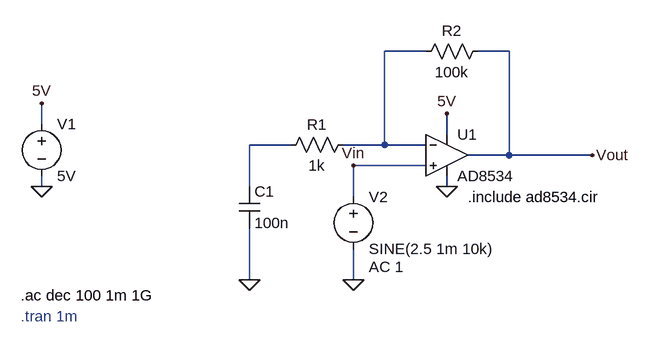
[diagram p0: schematic Amplifier.asc]
Amplifier.asc, the LTspice schematic file:
Version 4
SHEET 1 880 680
WIRE 176 16 112 16
WIRE 304 16 256 16
WIRE -416 128 -416 96
WIRE 208 144 208 112
WIRE -32 160 -96 160
WIRE 112 160 112 16
WIRE 112 160 48 160
WIRE 176 160 112 160
WIRE 304 176 304 16
WIRE 304 176 240 176
WIRE 432 176 304 176
WIRE 176 192 64 192
WIRE -416 224 -416 208
WIRE -96 224 -96 160
WIRE 208 224 208 208
WIRE 64 240 64 192
WIRE -96 368 -96 288
WIRE 64 368 64 320
FLAG 208 224 0
FLAG -416 224 0
FLAG -416 96 5V
FLAG 208 112 5V
FLAG 64 368 0
FLAG 432 176 Vout
FLAG 64 192 Vin
FLAG -96 368 0
SYMBOL OpAmps\\opamp2 208 112 R0
SYMATTR InstName U1
SYMATTR Value AD8534
SYMBOL voltage -416 112 R0
WINDOW 123 0 0 Left 0
WINDOW 39 0 0 Left 0
SYMATTR InstName V1
SYMATTR Value 5V
SYMBOL voltage 64 224 R0
WINDOW 123 24 124 Left 2
WINDOW 39 0 0 Left 0
SYMATTR Value2 AC 1
SYMATTR InstName V2
SYMATTR Value SINE(2.5 1m 10k)
SYMBOL res 64 144 R90
WINDOW 0 0 56 VBottom 2
WINDOW 3 32 56 VTop 2
SYMATTR InstName R1
SYMATTR Value 1k
SYMBOL res 272 0 R90
WINDOW 0 0 56 VBottom 2
WINDOW 3 32 56 VTop 2
SYMATTR InstName R2
SYMATTR Value 100k
SYMBOL cap -112 224 R0
SYMATTR InstName C1
SYMATTR Value 100n
TEXT 240 240 Left 2 !.include ad8534.cir
TEXT -448 392 Left 2 !.ac dec 100 1m 1G
TEXT -448 424 Left 2 ;.tran 1m

The netlist it stands for:
* Amplifier.asc
XU1 Vin N001 5V 0 Vout AD8534  ; pins In+ In- V+ V- OUT
V1 5V 0 5V
V2 Vin 0 SINE(2.5 1m 10k) AC 1
R1 N001 N002 1k
R2 Vout N001 100k
C1 N002 0 100n
.include ad8534.cir
.ac dec 100 1m 1G
* .tran 1m
.backanno
.end